# Altium schematic sheet Power - 5V0.SchDoc
size A4; PageSetup: Record=PageOptions|CenterHorizontal=True|CenterVertical=True|PrintScale=1.00|XCorrection=1.00|YCorrection=1.00|PrintKind=1|BorderSize=5000000|LeftOffset=0|BottomOffset=0|Orientation=2|PaperLength=1000|PaperWidth=1000|Scale=100|PaperSource=7|PrintQuality=-3|MediaType=1|DitherType=10|PrintScaleMode=1|PaperKind=Letter|PaperIndex=119
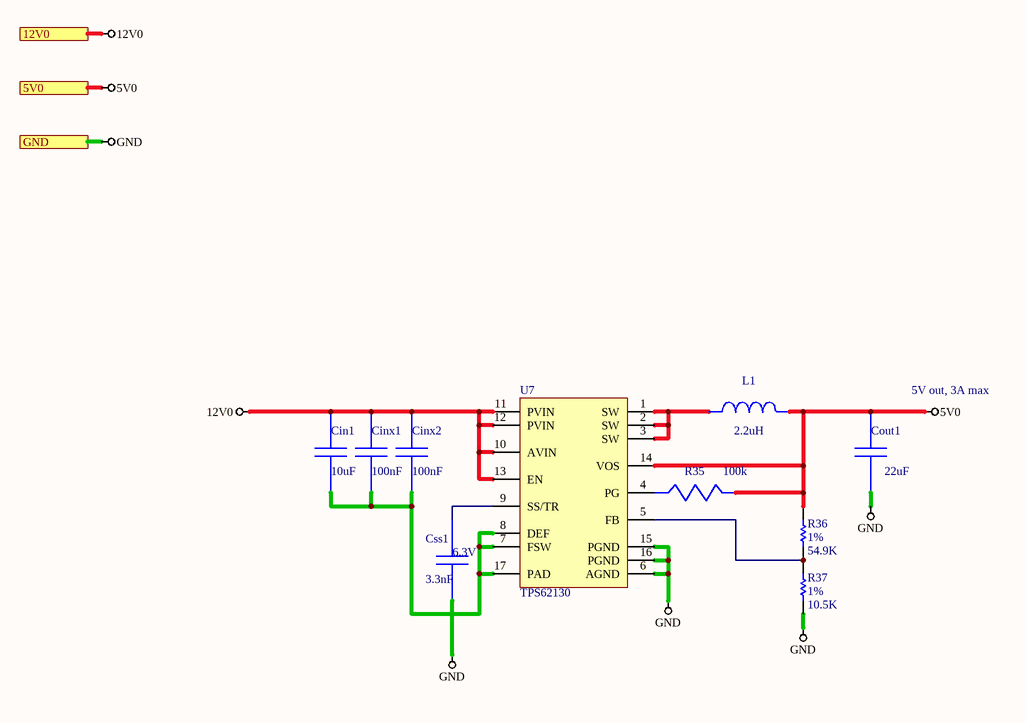
[diagram p0: Power - 5V0.SchDoc]

## Parts
Cin1  value 10uF  [1206]  (hidden comment: GRM31CR61E106KA12L)
Cinx1  value 100nF  [C-0603]  (hidden comment: C0603C104K3RACTU)
Cinx2  value 100nF  [C-0603]  (hidden comment: C0603C104K3RACTU)
Cout1  value 22uF  [C-0805]  (hidden comment: LMK212BJ226MG-T)
Css1  6.3V  value 3.3nF  [CAPC0402(1005)60_L]
L1  value 2.2uH  [XAL4020]  (hidden comment: XAL4020-222MEB)
R35  value 100k  [CAPC0402(1005)60_L]  (hidden comment: CRCW0402100KFKED)
R36  1%  value 54.9K  [RESC0402(1005)40_L]
R37  1%  value 10.5K  [RESC0402(1005)40_L]
U7  TPS62130  [S-PVQFN-N16]

## Ports
5V0, 12V0, GND

## Nets
5V0: Cout1.1 L1.2 R35.1 R36.2 U7.14(VOS) ; port 5V0
12V0: Cin1.1 Cinx1.1 Cinx2.1 U7.10(AVIN) U7.11(PVIN) U7.12(PVIN) U7.13(EN) ; port 12V0
GND: Cout1.2 Css1.2 R37.1 U7.6(AGND) U7.15(PGND) U7.16(PGND) ; port GND
NetCin1_2: Cin1.2 Cinx1.2 Cinx2.2 U7.7(FSW) U7.8(DEF) U7.17(PAD)
NetCss1_1: Css1.1 U7.9(SS/TR)
NetL1_1: L1.1 U7.1(SW) U7.2(SW) U7.3(SW)
NetR35_2: R35.2 U7.4(PG)
NetR36_1: R36.1 R37.2 U7.5(FB)

## Notes on the sheet
- (near Cout1) 5V out, 3A max

## Library data of the parts
Cin1 = GRM31CR61E106KA12L: GRM31CR61E106KA1; Manufacturer Name: MuRata; PackageReference: GRM31CR61E106KA12L; Manufacturer Part Number: GRM31CR61E106KA12L
Cinx1 Cinx2 = C0603C104K3RACTU: Manufacturer Name: Kemet; PackageReference: C0603C104K3RACTU; Manufacturer Part Number: C0603C104K3RACTU
Cout1 = LMK212BJ226MG-T: Manufacturer Name: Taiyo Yuden; PackageReference: LMK212BJ226MG-T; Manufacturer Part Number: LMK212BJ226MG-T
Css1 = GRM1555C1E621JA01D: GRM022R60J332KE19D; Manufacturer Name: MuRata; PackageReference: GRM022R60J332KE19D; Manufacturer Part Number: GRM022R60J332KE19D
L1 = XAL4020-222MEB: Manufacturer Name: Coilcraft; PackageReference: XAL4020-222MEB; Manufacturer Part Number: XAL4020-222MEB
R35 = CRCW0402100KFKED: Manufacturer Name: Vishay-Dale; PackageReference: CRCW0402100KFKED; Manufacturer Part Number: CRCW0402100KFKED
R36 R37 = Res1: Resistor; Published: 8-Jun-2000; LatestRevisionDate: 17-Jul-2002; LatestRevisionNote: Re-released for DXP Platform.; PackageReference: AXIAL-0.3; Publisher: Altium Limited; PackageDescription: Axial Device, Thru-Hole; 2 Leads; 0.3 in Pin Spacing
U7 = TPS6213X